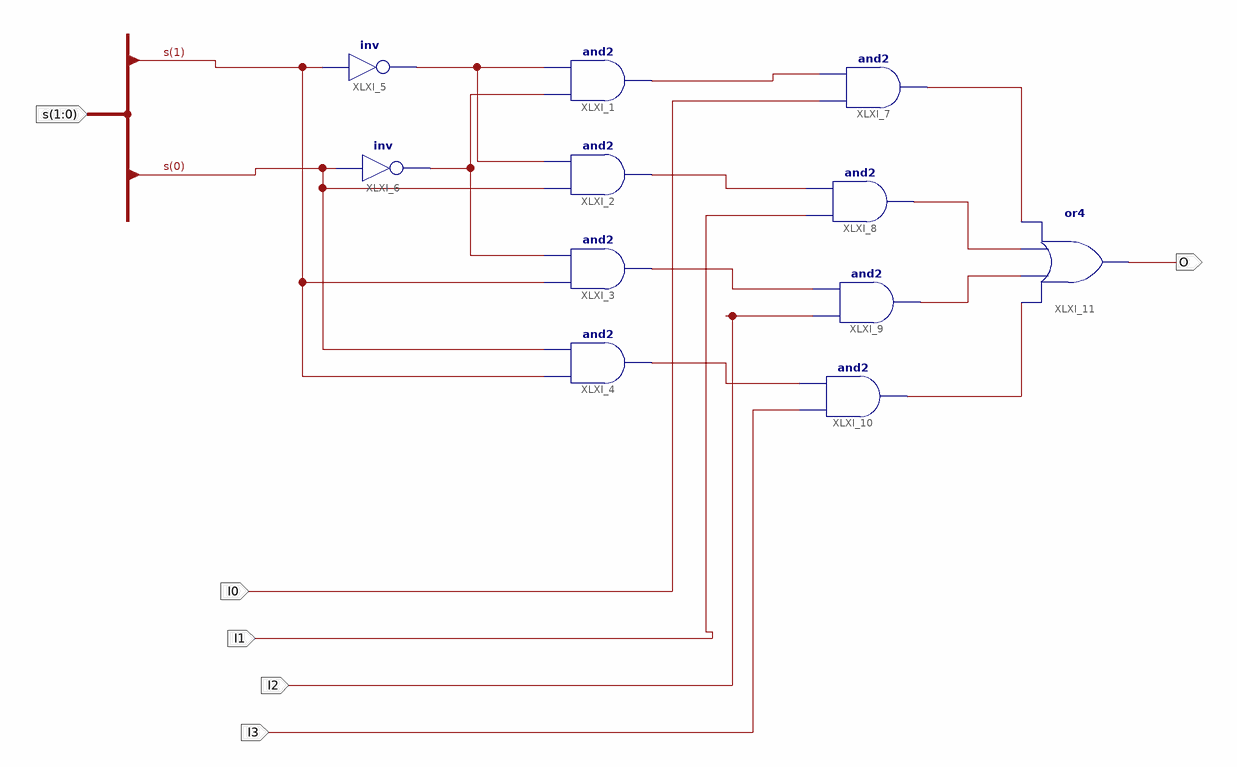
[diagram p0: schematic sheet 1]
// Xilinx ISE schematic Mux4to1.sch (kintex7) as structural Verilog: 11 symbols, 6 ports
module Mux4to1 (
  input  [1:0] s,
  input  I0,
  input  I1,
  input  I2,
  input  I3,
  output O
);

  wire XLXN_2, XLXN_3, XLXN_14, XLXN_15, XLXN_16, XLXN_17, XLXN_25, XLXN_26, XLXN_27, XLXN_28;

  and XLXI_1 (XLXN_14, XLXN_3, XLXN_2);
  and XLXI_2 (XLXN_15, s[0], XLXN_2);
  and XLXI_3 (XLXN_16, s[1], XLXN_3);
  and XLXI_4 (XLXN_17, s[1], s[0]);
  not XLXI_5 (XLXN_2, s[1]);
  not XLXI_6 (XLXN_3, s[0]);
  and XLXI_7 (XLXN_25, I0, XLXN_14);
  and XLXI_8 (XLXN_26, I1, XLXN_15);
  and XLXI_9 (XLXN_27, I2, XLXN_16);
  and XLXI_10 (XLXN_28, I3, XLXN_17);
  or XLXI_11 (O, XLXN_28, XLXN_27, XLXN_26, XLXN_25);
endmodule
